# EAGLE schematic On Board Computer (EAGLE 9.6.2)

## Sheet 1 of 3
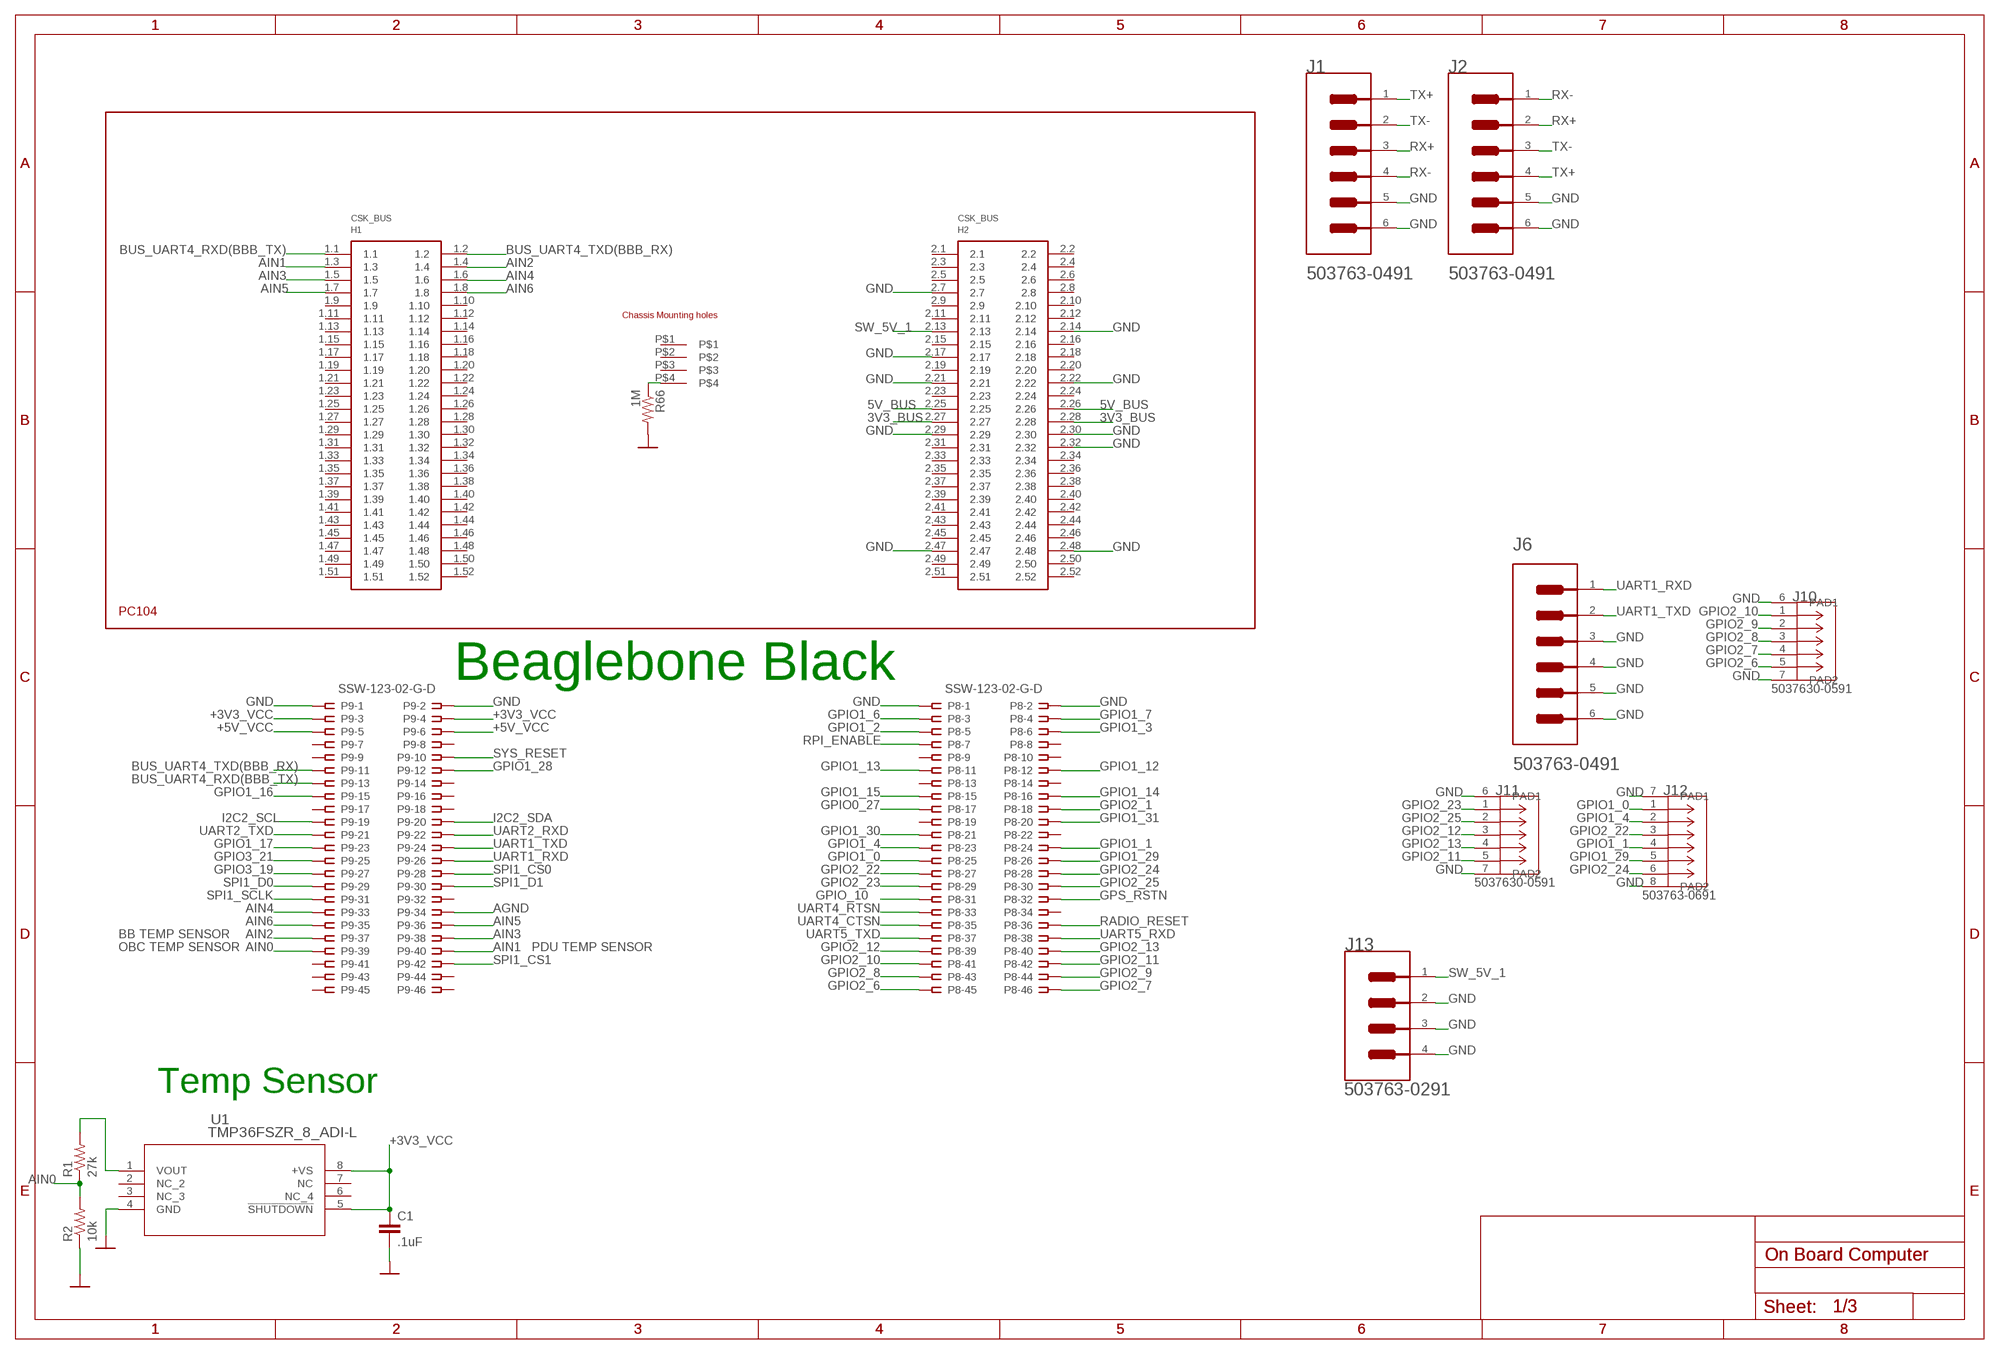
[diagram p0: schematic, sheet 1]

### Parts
C1  .1uF  CAP0805  [0805]
H1  PC104_WCONN  [PC104_WCONN]
J1  MOLEX_503763-0491MOLEX_503763-0491_0_0  [MOLEX_503763-0491_0]
J2  MOLEX_503763-0491MOLEX_503763-0491_0_0  [MOLEX_503763-0491_0]
J6  MOLEX_503763-0491MOLEX_503763-0491_0_0  [MOLEX_503763-0491_0]
J10  503763-0591  [CONN_5037630591_MOL]
J11  503763-0591  [CONN_5037630591_MOL]
J12  503763-0691  [CONN_503763-0691_MOL]
J13  MOLEX_503763-0291MOLEX_503763-0291_0_0  [MOLEX_503763-0291_0]
P8  SSW-123-02-G-D  [SSW-123-02-G-D]
P9  SSW-123-02-G-D  [SSW-123-02-G-D]
R1  27k  RESISTOR0805-RES  [0805]
R2  10k  RESISTOR0805-RES  [0805]
R66  1M  RESISTOR0805-RES  [0805]
U1  TMP36FSZR_8_ADI-L  [R_8_ADI-L]

### Nets
3V3_BUS: H1.2.27 H1.2.28 ; also sheet 3
5V_BUS: H1.2.25 H1.2.26
+3V3_VCC: C1.1 P9.3 P9.4 U1.5(!SHUTDOWN) U1.8(+VS) ; also sheet 3
+5V_VCC: P9.5 P9.6 ; also sheet 2
AGND: P9.34
AIN0: P9.39 R1.1 R2.2
AIN1: H1.1.3 P9.40
AIN2: H1.1.4 P9.37
AIN3: H1.1.5 P9.38
AIN4: H1.1.6 P9.33
AIN5: H1.1.7 P9.36
AIN6: H1.1.8 P9.35
BUS_UART4_RXD(BBB_TX): H1.1.1 P9.13
BUS_UART4_TXD(BBB_RX): H1.1.2 P9.11
GND: C1.2 H1.2.7 H1.2.14 H1.2.17 H1.2.21 H1.2.22 H1.2.29 H1.2.30 H1.2.32 H1.2.47 H1.2.48 J1.5(MNT_1) J1.6(MNT_2) J2.5(MNT_1) J2.6(MNT_2) J6.3 J6.4 J6.5(MNT_1) J6.6(MNT_2) J10.6(PAD1) J10.7(PAD2) J11.6(PAD1) J11.7(PAD2) J12.7(PAD1) J12.8(PAD2) J13.2 J13.3(MNT_1) J13.4(MNT_2) P8.1 P8.2 P9.1 P9.2 R2.1 R66.2 U1.4(GND) ; also sheet 2,3
GPIO0_27: P8.17
GPIO1_0: J12.1 P8.25
GPIO1_1: J12.4 P8.24
GPIO1_2: P8.5
GPIO1_3: P8.6
GPIO1_4: J12.2 P8.23
GPIO1_6: P8.3
GPIO1_7: P8.4
GPIO1_12: P8.12
GPIO1_13: P8.11
GPIO1_14: P8.16
GPIO1_15: P8.15
GPIO1_16: P9.15
GPIO1_17: P9.23
GPIO1_28: P9.12
GPIO1_29: J12.5 P8.26
GPIO1_30: P8.21
GPIO1_31: P8.20
GPIO2_1: P8.18
GPIO2_6: J10.5 P8.45
GPIO2_7: J10.4 P8.46
GPIO2_8: J10.3 P8.43
GPIO2_9: J10.2 P8.44
GPIO2_10: J10.1 P8.41
GPIO2_11: J11.5 P8.42
GPIO2_12: J11.3 P8.39
GPIO2_13: J11.4 P8.40
GPIO2_22: J12.3 P8.27
GPIO2_23: J11.1 P8.29
GPIO2_24: J12.6 P8.28
GPIO2_25: J11.2 P8.30
GPIO3_19: P9.27
GPIO3_21: P9.25
GPIO_10: P8.31
GPS_RSTN: P8.32 ; also sheet 3
I2C2_SCL: P9.19 ; also sheet 3
I2C2_SDA: P9.20 ; also sheet 3
N$15: R1.2 U1.1(VOUT)
N$94: H1.P$4 R66.1
RADIO_RESET: P8.36 ; also sheet 3
RPI_ENABLE: P8.7 ; also sheet 2
RX+: J1.3 J2.2
RX-: J1.4 J2.1
SPI1_CS0: P9.28
SPI1_CS1: P9.42 ; also sheet 3
SPI1_D0: P9.29 ; also sheet 3
SPI1_D1: P9.30 ; also sheet 3
SPI1_SCLK: P9.31 ; also sheet 3
SW_5V_1: H1.2.13 J13.1
SYS_RESET: P9.10
TX+: J1.1 J2.4
TX-: J1.2 J2.3
UART1_RXD: J6.1 P9.26
UART1_TXD: J6.2 P9.24
UART2_RXD: P9.22 ; also sheet 2
UART2_TXD: P9.21 ; also sheet 2
UART4_CTSN: P8.35
UART4_RTSN: P8.33
UART5_RXD: P8.38 ; also sheet 3
UART5_TXD: P8.37 ; also sheet 3
Unconnected: H1.1.9 H1.1.10 H1.1.11 H1.1.12 H1.1.13 H1.1.14 H1.1.15 H1.1.16 H1.1.17 H1.1.18 H1.1.19 H1.1.20 H1.1.21 H1.1.22 H1.1.23 H1.1.24 H1.1.25 H1.1.26 H1.1.27 H1.1.28 H1.1.29 H1.1.30 H1.1.31 H1.1.32 H1.1.33 H1.1.34 H1.1.35 H1.1.36 H1.1.37 H1.1.38 H1.1.39 H1.1.40 H1.1.41 H1.1.42 H1.1.43 H1.1.44 H1.1.45 H1.1.46 H1.1.47 H1.1.48 H1.1.49 H1.1.50 H1.1.51 H1.1.52 H1.2.1 H1.2.2 H1.2.3 H1.2.4 H1.2.5 H1.2.6 H1.2.8 H1.2.9 H1.2.10 H1.2.11 H1.2.12 H1.2.15 H1.2.16 H1.2.18 H1.2.19 H1.2.20 H1.2.23 H1.2.24 H1.2.31 H1.2.33 H1.2.34 H1.2.35 H1.2.36 H1.2.37 H1.2.38 H1.2.39 H1.2.40 H1.2.41 H1.2.42 H1.2.43 H1.2.44 H1.2.45 H1.2.46 H1.2.49 H1.2.50 H1.2.51 H1.2.52 H1.P$1 H1.P$2 H1.P$3 P8.8 P8.9 P8.10 P8.13 P8.14 P8.19 P8.22 P8.34 P9.7 P9.8 P9.9 P9.14 P9.16 P9.17 P9.18 P9.32 P9.41 P9.43 P9.44 P9.45 P9.46 U1.2(NC_2) U1.3(NC_3) U1.6(NC_4) U1.7(NC)

### Notes on the sheet
- Beaglebone Black
- BB TEMP SENSOR
- OBC TEMP SENSOR | PDU TEMP SENSOR
- Temp Sensor

## Sheet 2 of 3
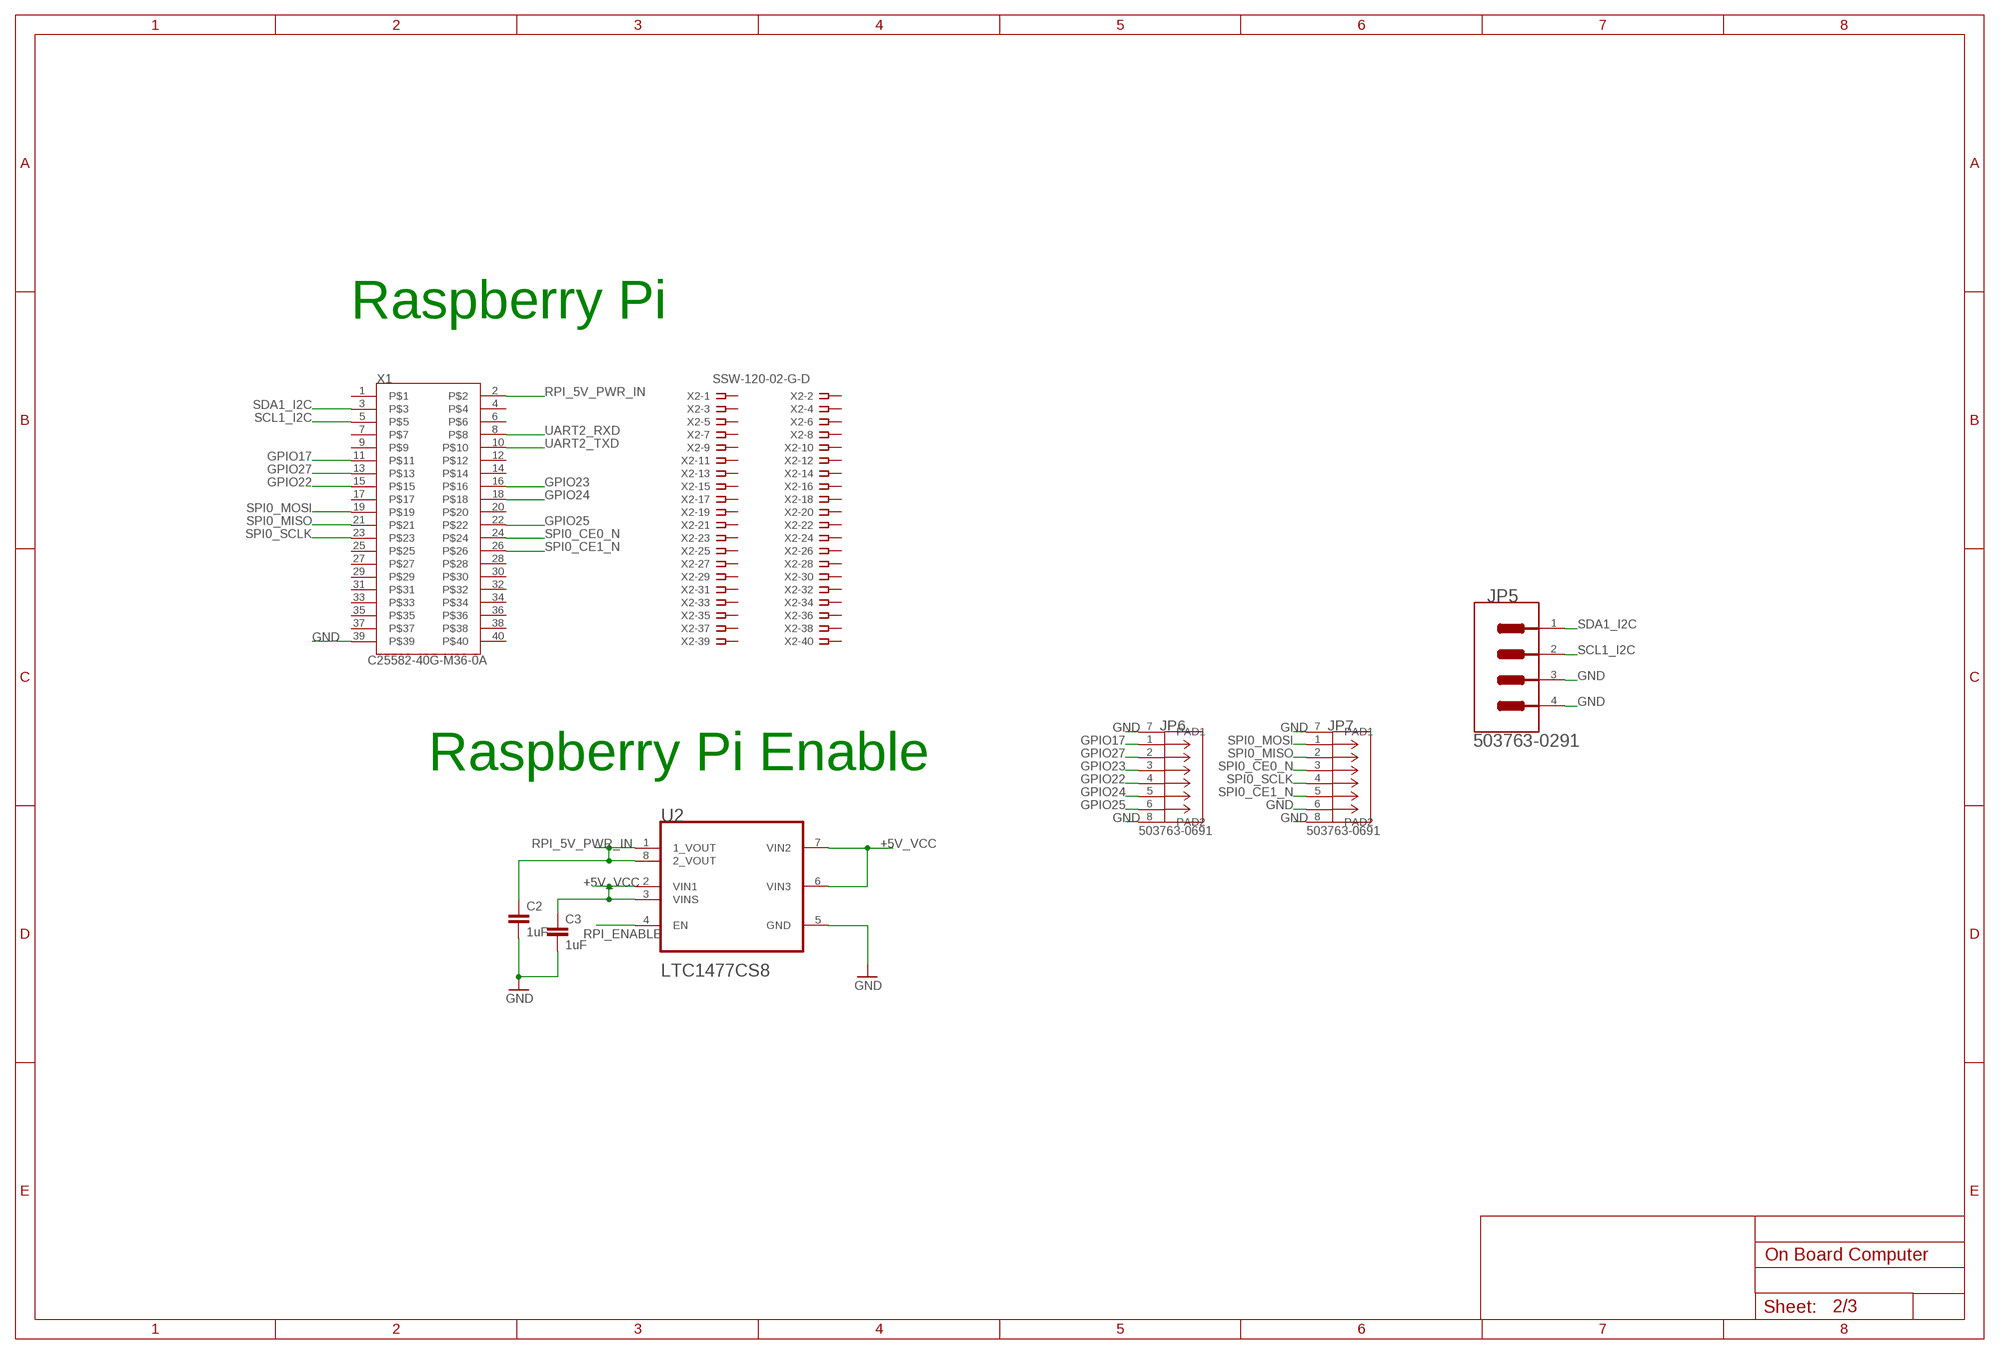
[diagram p1: schematic, sheet 2]

### Parts
C2  1uF  CAP0805  [0805]
C3  1uF  CAP0805  [0805]
JP5  MOLEX_503763-0291MOLEX_503763-0291_0_0  [MOLEX_503763-0291_0]
JP6  503763-0691  [CONN_503763-0691_MOL]
JP7  503763-0691  [CONN_503763-0691_MOL]
U2  LTC1477CS8LINEAR_TECHNOLOGY_LTC1477CS8_0_2  [LINEAR_TECHNOLOGY_LTC1477CS8_2]
X1  C25582-40G-M36-0A  [ADAFRUIT_C25582-40G-M36-0A_0]
X2  SSW-120-02-G-D  [SSW-120-02-G-D]

### Nets
+5V_VCC: C3.1 U2.2(VIN1) U2.3(VINS) U2.6(VIN3) U2.7(VIN2) ; also sheet 1
GND: C2.2 C3.2 JP5.3(MNT_1) JP5.4(MNT_2) JP6.7(PAD1) JP6.8(PAD2) JP7.6 JP7.7(PAD1) JP7.8(PAD2) U2.5(GND) X1.39 ; also sheet 1,3
GPIO17: JP6.1 X1.11
GPIO22: JP6.4 X1.15
GPIO23: JP6.3 X1.16
GPIO24: JP6.5 X1.18
GPIO25: JP6.6 X1.22
GPIO27: JP6.2 X1.13
RPI_5V_PWR_IN: C2.1 U2.1(1_VOUT) U2.8(2_VOUT) X1.2
RPI_ENABLE: U2.4(EN) ; also sheet 1
SCL1_I2C: JP5.2 X1.5
SDA1_I2C: JP5.1 X1.3
SPI0_CE0_N: JP7.3 X1.24
SPI0_CE1_N: JP7.5 X1.26
SPI0_MISO: JP7.2 X1.21
SPI0_MOSI: JP7.1 X1.19
SPI0_SCLK: JP7.4 X1.23
UART2_RXD: X1.8 ; also sheet 1
UART2_TXD: X1.10 ; also sheet 1
Unconnected: X1.1 X1.4 X1.6 X1.7 X1.9 X1.12 X1.14 X1.17 X1.20 X1.25 X1.27 X1.28 X1.29 X1.30 X1.31 X1.32 X1.33 X1.34 X1.35 X1.36 X1.37 X1.38 X1.40 X2.1 X2.2 X2.3 X2.4 X2.5 X2.6 X2.7 X2.8 X2.9 X2.10 X2.11 X2.12 X2.13 X2.14 X2.15 X2.16 X2.17 X2.18 X2.19 X2.20 X2.21 X2.22 X2.23 X2.24 X2.25 X2.26 X2.27 X2.28 X2.29 X2.30 X2.31 X2.32 X2.33 X2.34 X2.35 X2.36 X2.37 X2.38 X2.39 X2.40

### Notes on the sheet
- Raspberry Pi
- Raspberry Pi Enable

## Sheet 3 of 3
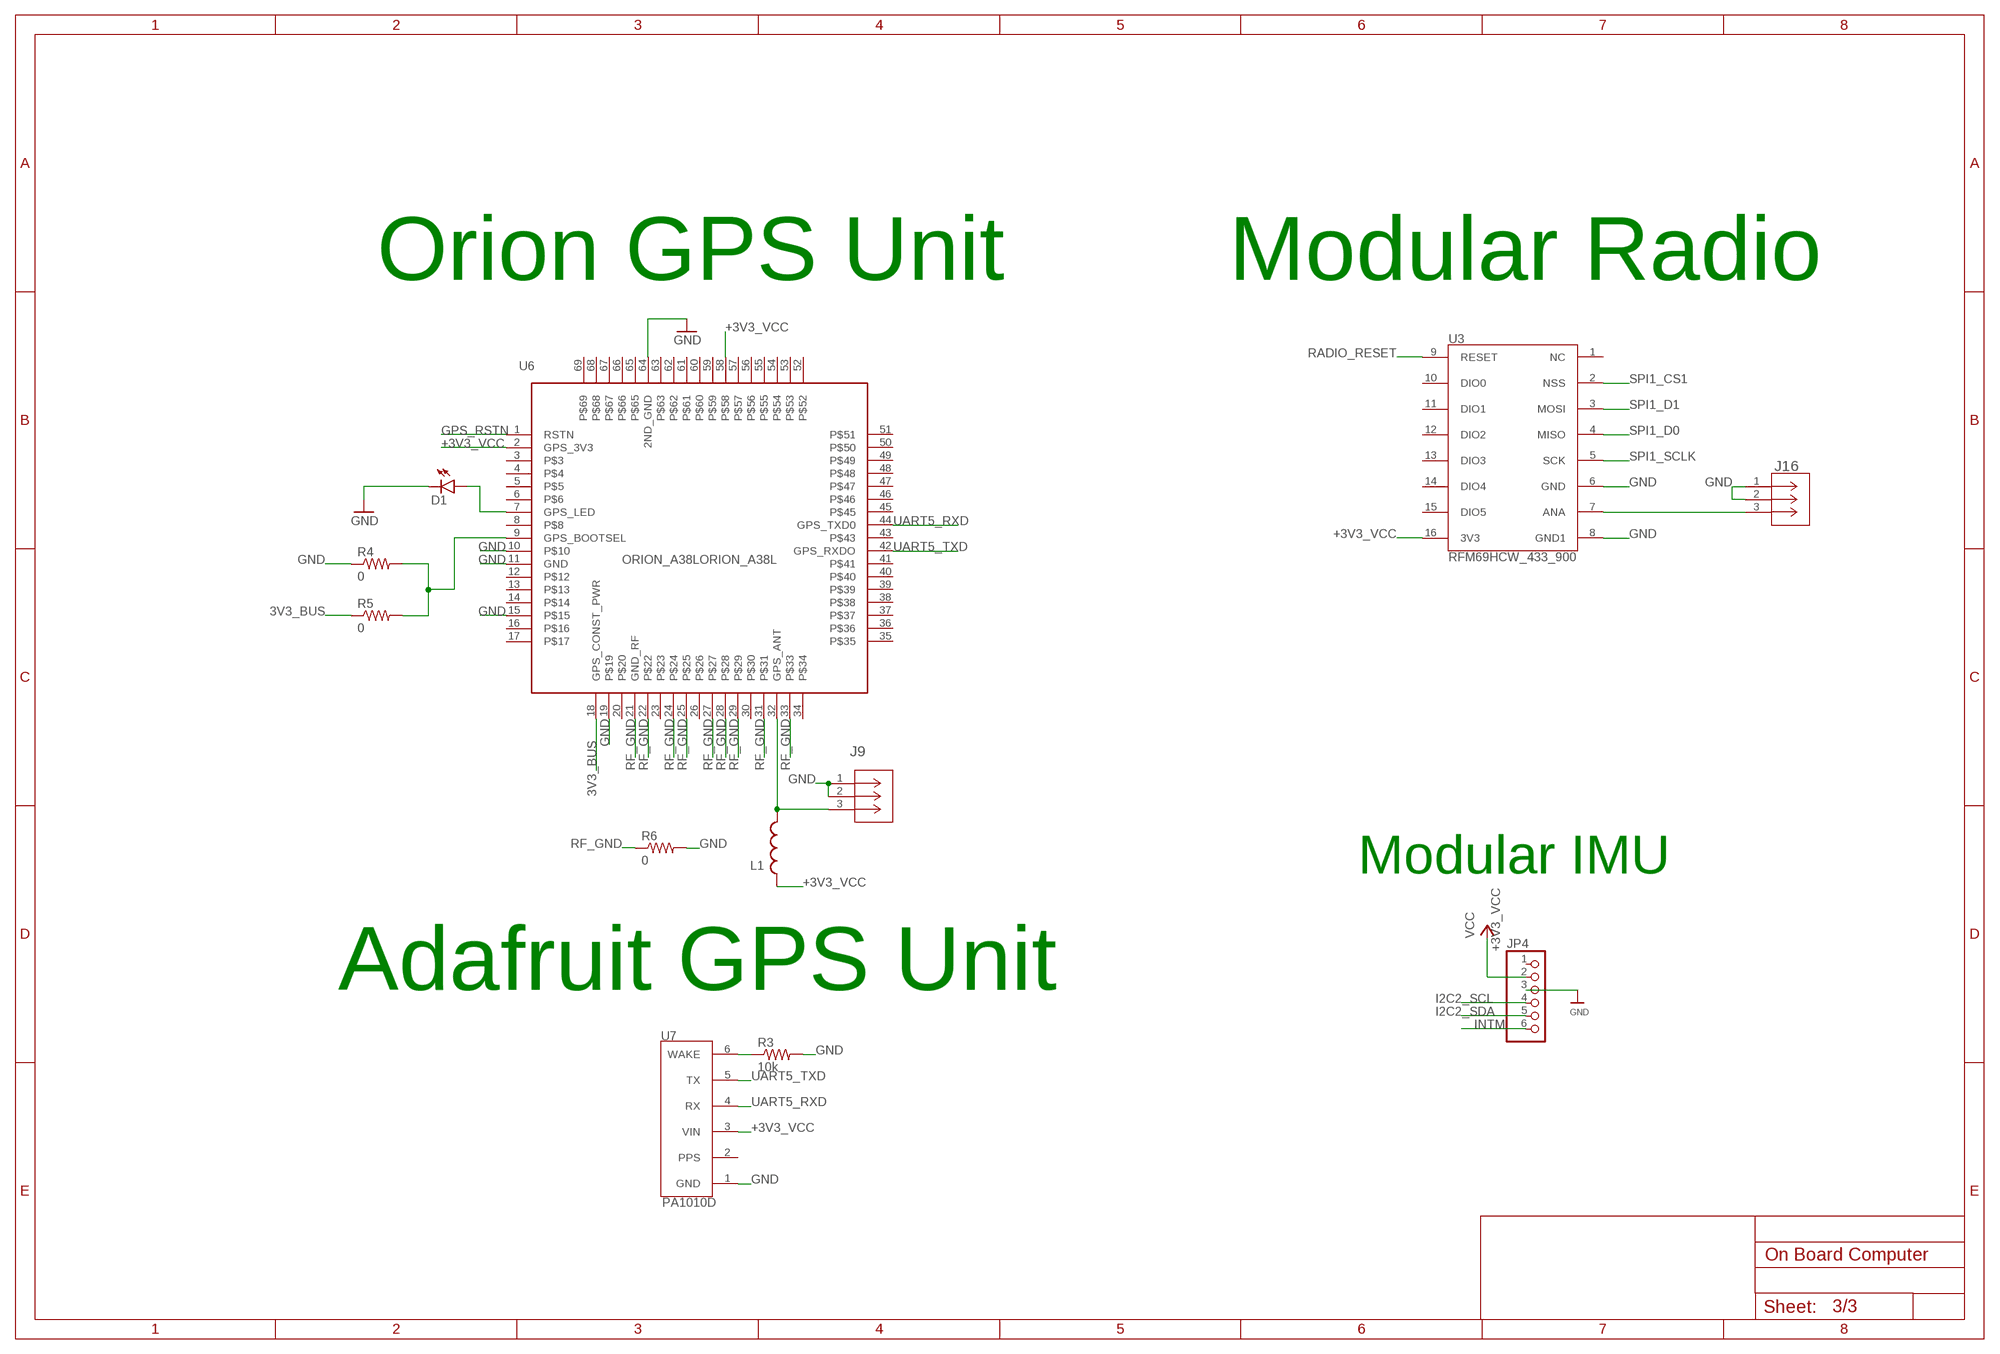
[diagram p2: schematic, sheet 3]

### Parts
D1  LEDCHIP-LED0603  [CHIP-LED0603]
J9  U.FL-R-SMT-1(01)  [CONN_-SMT-1(01)]
J16  U.FL-R-SMT-1(01)  [CONN_-SMT-1(01)]
JP4  HEADER-1X670MIL  [1X06_ROUND_70]
L1  L  [INDC2012X145N]
R3  10k  RESISTOR0805-RES  [0805]
R4  0  RESISTOR0805-RES  [0805]
R5  0  RESISTOR0805-RES  [0805]
R6  0  RESISTOR0805-RES  [0805]
U3  RFM69HCW_433_900  [RFM69HCW_433]
U6  ORION_A38LORION_A38L  [ORION_A38L]
U7  PA1010D  [PA1010D]

### Nets
3V3_BUS: R5.1 U6.18(GPS_CONST_PWR) ; also sheet 1
+3V3_VCC: JP4.2 L1.1 U3.16(3V3) U6.2(GPS_3V3) U6.58 U7.3(VIN) ; supply symbol labelled VCC ; also sheet 1
GND: D1.C J9.1 J9.2 J16.1 J16.2 JP4.3 R3.2 R4.1 R6.2 U3.6(GND) U3.8(GND1) U6.10 U6.11(GND) U6.15 U6.19 U6.64(2ND_GND) U7.1(GND) ; also sheet 1,2
GPS_RSTN: U6.1(RSTN) ; also sheet 1
I2C2_SCL: JP4.4 ; also sheet 1
I2C2_SDA: JP4.5 ; also sheet 1
INTM: JP4.6
N$12: J16.3 U3.7(ANA)
N$16: R4.2 R5.2 U6.9(GPS_BOOTSEL)
N$17: J9.3 L1.2 U6.32(GPS_ANT)
N$20: R3.1 U7.6(WAKE)
N$21: D1.A U6.7(GPS_LED)
RADIO_RESET: U3.9(RESET) ; also sheet 1
RF_GND: R6.1 U6.21(GND_RF) U6.22 U6.24 U6.25 U6.27 U6.28 U6.29 U6.31 U6.33
SPI1_CS1: U3.2(NSS) ; also sheet 1
SPI1_D0: U3.4(MISO) ; also sheet 1
SPI1_D1: U3.3(MOSI) ; also sheet 1
SPI1_SCLK: U3.5(SCK) ; also sheet 1
UART5_RXD: U6.44(GPS_TXD0) U7.4(RX) ; also sheet 1
UART5_TXD: U6.42(GPS_RXDO) U7.5(TX) ; also sheet 1
Unconnected: JP4.1 U3.1(NC) U3.10(DIO0) U3.11(DIO1) U3.12(DIO2) U3.13(DIO3) U3.14(DIO4) U3.15(DIO5) U6.3 U6.4 U6.5 U6.6 U6.8 U6.12 U6.13 U6.14 U6.16 U6.17 U6.20 U6.23 U6.26 U6.30 U6.34 U6.35 U6.36 U6.37 U6.38 U6.39 U6.40 U6.41 U6.43 U6.45 U6.46 U6.47 U6.48 U6.49 U6.50 U6.51 U6.52 U6.53 U6.54 U6.55 U6.56 U6.57 U6.59 U6.60 U6.61 U6.62 U6.63 U6.65 U6.66 U6.67 U6.68 U6.69 U7.2(PPS)

### Notes on the sheet
- Orion GPS Unit | Modular Radio
- Modular IMU
- Adafruit GPS Unit

## Library data of the parts
C1-C3 = HSFL_Main_Library:CAP: Capacitor Standard 0603 ceramic capacitor, and 0.1" leaded capacitor.
D1 = led:LED: LED OSRAM: - CHIPLED LG R971, LG N971, LY N971, LG Q971, LY Q971, LO R971, LY R971 LH N974, LH R974 LS Q976, LO Q976, LY Q976 LO Q996 - Hyper CHIPLED LW Q18S LB Q993, LB Q99A, LB R99A - SideLED LS A670, LO A670, LY A670, LG A670, LP A670 LB A673, LV A673, LT A673, LW A673 LH A674 LY A675 LS A676, LA A676, LO A676, LY A676, LW A676 LS A679, LY A679, LG A679 - Hyper Micro SIDELED® LS Y876, LA Y876, LO Y876, LY Y876 LT Y87S - SmartLED LW L88C, LW L88S LB L89C, LB L89S, LG L890 LS L89K, LO L89K, LY L89K LS L896, LA L896, LO L896, LY L896 - TOPLED LS T670, LO T670, LY T670, LG T670, LP T670 LSG T670, LSP T670, LSY T670, LOP T670, LYG T670 LG T671, LOG T671, LSG T671 LB T673, LV T673, LT T673, LW T673 LH T674 LS T676, LA T676, LO T676, LY T676, LB T676, LH T676, LSB T676, LW T676 LB T67C, LV T67C, LT T67C, LS T67K, LO T67K, LY T67K, LW E67C LS E67B, LA E67B, LO E67B, LY E67B, LB E67C, LV E67C, LT E67C LW T67C LS T679, LY T679, LG T679 LS T770, LO T770, LY T770, LG T770, LP T770 LB T773, LV T773, LT T773, LW T773 LH T774 LS E675, LA E675, LY E675, LS T675 LS T776, LA T776, LO T776, LY T776, LB T776 LHGB T686 LT T68C, LB T68C - Hyper Mini TOPLED® LB M676 - Mini TOPLED Santana® LG M470 LS M47K, LO M47K, LY M47K Source: http://www.osram.convergy.de LUXEON: - LUMILED® LXK2-PW12-R00, LXK2-PW12-S00, LXK2-PW14-U00, LXK2-PW14-V00 LXK2-PM12-R00, LXK2-PM12-S00, LXK2-PM14-U00 LXK2-PE12-Q00, LXK2-PE12-R00, LXK2-PE12-S00, LXK2-PE14-T00, LXK2-PE14-U00 LXK2-PB12-K00, LXK2-PB12-L00, LXK2-PB12-M00, LXK2-PB14-N00, LXK2-PB14-P00, LXK2-PB14-Q00 LXK2-PR12-L00, LXK2-PR12-M00, LXK2-PR14-Q00, LXK2-PR14-R00 LXK2-PD12-Q00, LXK2-PD12-R00, LXK2-PD12-S00 LXK2-PH12-R00, LXK2-PH12-S00 LXK2-PL12-P00, LXK2-PL12-Q00, LXK2-PL12-R00 Source: www.luxeon.com KINGBRIGHT: KA-3528ASYC Source: www.kingbright.com
H1 = HSFL_Main_Library:PC104_WCONN
J1 J2 J6 = Molex - 503763-0491:MOLEX_503763-0491: Wire-To-Board Connector, Pico-Lock 503763 Series, Surface Mount, Header, 4 Contacts, 1 mm; AUTOMOTIVE: No; CENTROID_NOT_SPECIFIED: No; CONN_GENDER: Male; CONN_ORIENTATION: Right Angle; CONTACT_MATERIAL: Gold,Nickel; CURRENT_RATING: 1.5A; DATASHEET: https://www.molex.com/webdocs/datasheets/pdf/en-us/5037630491_PCB_HEADERS.pdf; DEVICE_CLASS_L1: Connectors; DEVICE_CLASS_L2: Headers and Wire Housings; DEVICE_CLASS_L3: unset; DIGIKEY_DESCRIPTION: CONN HEADER 1MM R/A 4CKT; DIGIKEY_PART_NUMBER: WM10655CT-ND; FOOTPRINT_URL: https://www.molex.com/pdm_docs/sd/5037630491_sd.pdf; FOOTPRINT_VARIANT_NAME_0: Recommended_Land_Pattern; HEIGHT: 1.7mm; LEAD_FREE: Yes; MF: Molex; MFG_PACKAGE_IDENT: 503763-0491; MFG_PACKAGE_IDENT_DATE: 0; MFG_PACKAGE_IDENT_REV: 0; MOUSER_PART_NUMBER: 538-503763-0491; MPN: 503763-0491; NUMBER_OF_CONTACTS: 4; NUMBER_OF_ROWS: 1; PACKAGE: HDR4; PITCH: 1mm; PREFIX: J; ROHS: Yes; TEMPERATURE_RANGE_HIGH: +105°C; TEMPERATURE_RANGE_LOW: -40°C; VERIFICATION_VERSION: 0.0.0.1; VOLTAGE_RATING: 150V
J9 J16 = U.FL-R-SMT:U.FL-R-SMT-1(01); BUILT_BY: EMA_Matt; COPYRIGHT: Copyright (C) 2018 Accelerated Designs. All rights reserved; MANUFACTURER_PART_NUMBER: U.FL-R-SMT-1(01); SOURCELIBRARY: Hirose_12_20_2019; VENDOR: Hirose
J10 J11 = Improved Molex 503763-0591:503763-0591; BUILT_BY: EMA_Cory; COPYRIGHT: Copyright (C) 2018 Accelerated Designs. All rights reserved; DATASHEET: https://www.molex.com/pdm_docs/sd/5037630591_sd.pdf; MANUFACTURER_PART_NUMBER: 503763-0591; SOURCELIBRARY: Add_to_database_2020-12-14; VENDOR: Molex Connector Corporation
J12 JP6 JP7 = Improved Molex 503763-0691:503763-0691; BUILT_BY: EMA_Cory; COPYRIGHT: Copyright (C) 2018 Accelerated Designs. All rights reserved; DATASHEET: https://www.digikey.com/products/en?keywords=503763-0691; MANUFACTURER_PART_NUMBER: 503763-0691; SOURCELIBRARY: Molex_2020-01-22; VENDOR: Molex Connector Corporation
J13 JP5 = Molex - 503763-0291:MOLEX_503763-0291: 2 Positions Header Connector 0.039" (1.00mm) Surface Mount, Right Angle Gold; CENTROID_NOT_SPECIFIED: No; DATASHEET: http://www.molex.com/pdm_docs/sd/5037630291_sd.pdf; DIGIKEY_DESCRIPTION: CONN HEADER 1MM R/A 2CKT; DIGIKEY_PART_NUMBER: WM10654CT-ND; LEAD_FREE: yes; MF: Molex; MOUSER_PART_NUMBER: 538-503763-0291; MPN: 503763-0291; PACKAGE: HDR02; PREFIX: J; ROHS: yes; TEMPERATURE_RANGE_HIGH: +105°C; TEMPERATURE_RANGE_LOW: -40°C
JP4 = microbuilder:HEADER-1X6: PIN HEADER
L1 = L:L; DESCRIPTION: Inductor with Inductance: 10uH Tol. +/-20%, Package: 0805 (2012); DIGI-KEY_PART_NUMBER: 490-18463-1-ND; MF: Murata Electronics North America; MP: LQM21DH100M70L; PACKAGE: 2012 Bourns
P8 P9 = con-samtec:SSW-123-02-G: THROUGH-HOLE .025" SQ POST SOCKET Source: Samtec SSW.pdf; MF: Samtec Inc.; MPN: SSW-123-02-G-D; OC_FARNELL: unknown; OC_NEWARK: 11P9690
R1-R6 R66 = HSFL_Main_Library:RESISTOR: Resistor Basic schematic elements and footprints for 0603, 1206, and PTH resistors.
U1 = TMP36FSZR_8:TMP36FSZ; COPYRIGHT: Copyright (C) 2021 Ultra Librarian. All rights reserved.; MANUFACTURER_PART_NUMBER: TMP36FSZ; MFR_NAME: Analog Devices Inc
U2 = Artemis:LTC1477CS8: LT-LTC1477-S8-8; CIIVA_IDS: 1432281; COMPONENT_LINK_1_DESCRIPTION: Manufacturer URL; COMPONENT_LINK_1_URL: http://www.linear.com/; COMPONENT_LINK_3_DESCRIPTION: Package Specification; COMPONENT_LINK_3_URL: http://cds.linear.com/docs/en/packaging/05081610_G_SO8.pdf; DATASHEET: http://cds.linear.com/docs/en/datasheet/lt1477.pdf; FOOTPRINT_VARIANT_NAME_0: Level C; FOOTPRINT_VARIANT_NAME_1: Level B; FOOTPRINT_VARIANT_NAME_2: Level A; IMPORTED: yes; IMPORTED_FROM: vault; IMPORT_TS: 1521843574; MF: Linear Technology; MOUNTING_TECHNOLOGY: Surface Mount; MPN: LTC1477CS8; PACKAGE: S8-8; PACKAGE_DESCRIPTION: 8-Pin Plastic Small Outline (Narrow .150 Inch), Body 4.9 x 3.9 mm, Pitch 1.27 mm; PACKAGE_VERSION: Rev. G, 03/2012; PREFIX: U; RELEASE_DATE: 1377817843; ROHS: No; VAULT_GUID: 635B2D7C-EC07-409E-A57F-666E02CD64AC; VAULT_REVISION: 6B8B57C2-2CB3-4970-A31A-1EB58B636423
U3 = RFM69HCW:RFM69HCW_433_900: Rfm69hcw Wireless Transceiver 91 Check prices <https://pricing.snapeda.com/parts/RFM69HCW-315S2/HOPERF/view-part?ref=eda>
U6 = Artemis:ORION_A38L
U7 = Adafruit PA1010D Mini GPS:PA1010D
X1 = Adafruit - C25582-40G-M36-0A:C25582-40G-M36-0A
X2 = con-samtec-edited:SSW-120-02-G: THROUGH-HOLE .025" SQ POST SOCKET Source: Samtec SSW.pdf; MF: Samtec Inc.; MPN: SSW-120-02-G-D; OC_FARNELL: unknown; OC_NEWARK: 11P9639

## Net classes
1 highpower: width 0.406 mm, drill 0.483 mm
2 lowpower: width 0.305 mm, drill 0.483 mm